# EAGLE schematic mic4606_test_irf_mosfets_v0001 (EAGLE 6.4)
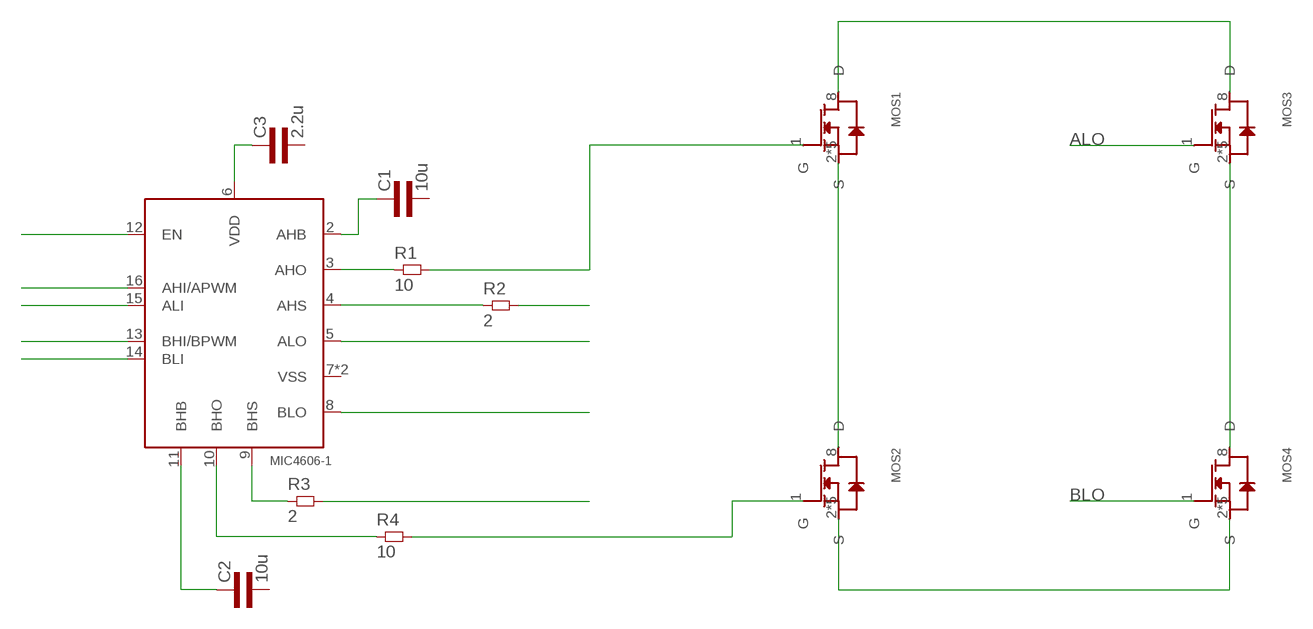
[diagram p0: schematic, sheet 1]

## Parts
C1  10u  CAP1206L3  [1206L3]
C2  10u  CAP1206L3  [1206L3]
C3  2.2u  CAP1206L3  [1206L3]
MD1  MIC4606-1  [QFN44-16LD-PL-2]
MOS1  MOSFET-NDPAK2-7  [DPAK2-7]
MOS2  MOSFET-NDPAK2-7  [DPAK2-7]
MOS3  MOSFET-NDPAK2-7  [DPAK2-7]
MOS4  MOSFET-NDPAK2-7  [DPAK2-7]
R1  10  RES1206L3  [1206L3]
R2  2  RES1206L3  [1206L3]
R3  2  RES1206L3  [1206L3]
R4  10  RES1206L3  [1206L3]

## Nets
ALO: MD1.5(ALO) MOS3.1(G)
BLO: MD1.8(BLO) MOS4.1(G)
N$1: MD1.12(EN)
N$2: MD1.16(AHI/APWM)
N$3: MD1.15(ALI)
N$4: MD1.13(BHI/BPWM)
N$5: MD1.14(BLI)
N$6: MD1.9(BHS) R3.1
N$7: MD1.10(BHO) R4.1
N$8: MD1.3(AHO) R1.1
N$9: MD1.4(AHS) R2.1
N$10: MOS1.1(G) R1.2
N$13: MOS2.1(G) R4.2
N$14: R3.2
N$15: R2.2
N$16: C1.1 MD1.2(AHB)
N$17: C2.1 MD1.11(BHB)
N$18: C3.1 MD1.6(VDD)
N$19: MOS1.8(D) MOS3.8(D)
N$20: MOS2.2(S) MOS2.3(S) MOS2.5(S) MOS2.6(S) MOS2.7(S) MOS4.2(S) MOS4.3(S) MOS4.5(S) MOS4.6(S) MOS4.7(S)
N$21: MOS1.2(S) MOS1.3(S) MOS1.5(S) MOS1.6(S) MOS1.7(S) MOS2.8(D)
N$22: MOS3.2(S) MOS3.3(S) MOS3.5(S) MOS3.6(S) MOS3.7(S) MOS4.8(D)
Unconnected: C1.2 C2.2 C3.2 MD1.7(VSS) MD1.TP(VSS)

## Library data of the parts
C1-C3 = common:CAP
MD1 = common:MIC4606: 85V Full-Bridge Mosfet Driver
MOS1-MOS4 = common:MOSFET-N
R1-R4 = common:RES